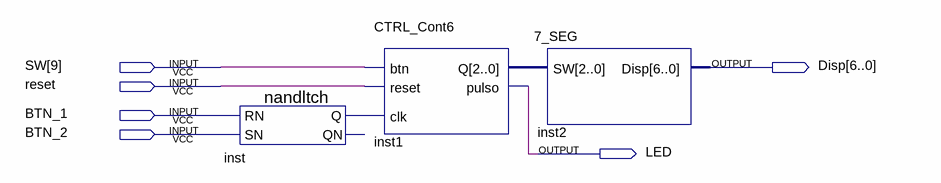
[diagram p0: schematic sheet]
// Quartus schematic TAREA2_C.bdf as structural Verilog: 3 symbols, 6 pins
module TAREA2_C (
  input  [9:9] SW,
  input  reset,
  input  BTN_1,
  input  BTN_2,
  output [6:0] Disp,
  output LED
);

  wire inst_q;
  wire [2:0] inst1_q;

  nandltch inst (.RN(BTN_1), .SN(BTN_2), .Q(inst_q));  // open: QN
  CTRL_Cont6 inst1 (.btn(SW[9]), .reset(reset), .clk(inst_q), .Q(inst1_q), .pulso(LED));
  \7_SEG  inst2 (.SW(inst1_q), .Disp(Disp));
endmodule
